# EAGLE schematic basestation (EAGLE 7.1.0)
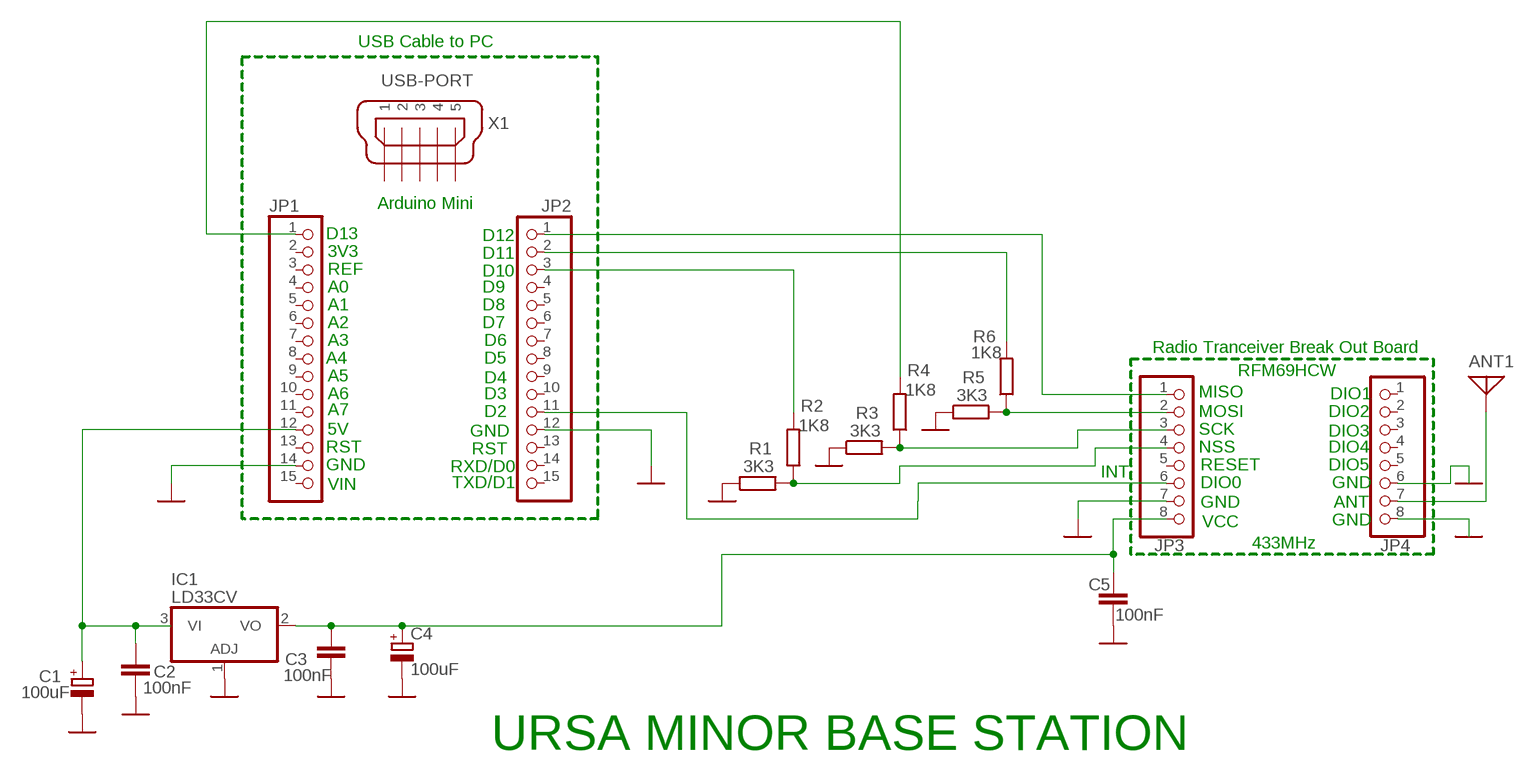
[diagram p0: schematic, sheet 1]

## Parts
ANT1  ANTENNA  [PAD-01]
C1  100uF  CPOL-EUE2.5-7  [E2,5-7]
C2  100nF  C2.5/2  [C2.5-2]
C3  100nF  C2.5/2  [C2.5-2]
C4  100uF  CPOL-EUE2.5-7  [E2,5-7]
C5  100nF  C2.5/2  [C2.5-2]
IC1  LD33CV  317T  [TO220H]
JP1  PINHD-1X15  [1X15]
JP2  PINHD-1X15  [1X15]
JP3  PINHD-1X8  [1X08]
JP4  PINHD-1X8  [1X08]
R1  3K3  R-EU_0204_2V  [0204V]
R2  1K8  R-EU_0204_2V  [0204V]
R3  3K3  R-EU_0204_2V  [0204V]
R4  1K8  R-EU_0204_2V  [0204V]
R5  3K3  R-EU_0204_2V  [0204V]
R6  1K8  R-EU_0204_2V  [0204V]
X1  USB-PORT  MINI-USB-32005-201  [32005-201]

## Nets
GND: C1.- C2.2 C3.2 C4.- C5.1 IC1.1(ADJ) JP1.14 JP2.12 JP3.7 JP4.6 R1.1 R3.1 R5.1
N$2: JP2.11 JP3.6
N$4: C1.+ C2.1 IC1.3(VI) JP1.12
N$5: C3.1 C4.+ C5.2 IC1.2(VO) JP3.8
N$32: ANT1.1 JP4.7
N$33: JP3.2 R5.2 R6.1
N$34: JP3.3 R3.2 R4.1
N$38: JP4.8
N$41: JP3.4 R1.2 R2.1
N$49: JP2.1 JP3.1
N$51: JP2.2 R6.2
N$52: JP1.1 R4.2
N$53: JP2.3 R2.2
Unconnected: JP1.2 JP1.3 JP1.4 JP1.5 JP1.6 JP1.7 JP1.8 JP1.9 JP1.10 JP1.11 JP1.13 JP1.15 JP2.4 JP2.5 JP2.6 JP2.7 JP2.8 JP2.9 JP2.10 JP2.13 JP2.14 JP2.15 JP3.5 JP4.1 JP4.2 JP4.3 JP4.4 JP4.5 X1.1 X1.2 X1.3 X1.4 X1.5

## Notes on the sheet
- USB Cable to PC
- Arduino Mini
- D13 | D12
- 3V3 | D11
- REF | D10
- A0 | D9
- A1 | D8
- A2 | D7
- A3 | D6
- Radio Tranceiver Break Out Board
- A4 | D5
- RFM69HCW
- A5 | D4
- A6 | D3 | MISO | DIO1
- A7 | D2 | MOSI | DIO2
- 5V | GND | SCK | DIO3
- RST | RST | NSS | DIO4
- GND | RXD/D0 | RESET | DIO5
- INT
- VIN | TXD/D1 | DIO0 | GND
- GND | ANT
- VCC | GND
- 433MHz
- URSA MINOR BASE STATION

## Library data of the parts
ANT1 = discrete:ANTENNA: Antenna
C1 C4 = rcl:CPOL-EU: POLARIZED CAPACITOR, European symbol
C2 C3 C5 = capacitor-wima:C: CAPACITOR naming: grid - package width
IC1 = linear:*317: Positive VOLTAGE REGULATOR
JP1 JP2 = pinhead:PINHD-1X15: PIN HEADER
JP3 JP4 = pinhead:PINHD-1X8: PIN HEADER
R1-R6 = resistor:R-EU_: RESISTOR, European symbol; SPICEPREFIX: R
X1 = con-cypressindustries:MINI-USB-: MINI USB-B Conector Source: www.cypressindustries.com; OC_FARNELL: unknown; OC_NEWARK: unknown